# Altium schematic sheet SkyPulse_UAV_Motherboard.SchDoc: SkyPulse UAV
size A4; Project: No.1; ENG_APP_DATE: --/--/--; DSN_APP_DATE: --/--/--; CHK_APP_DATE: --/--/--; Date: Feb. 04, 2024; Author: Binhan Tian; Revision: V0.1; SheetNumber: 1; SheetTotal: 3
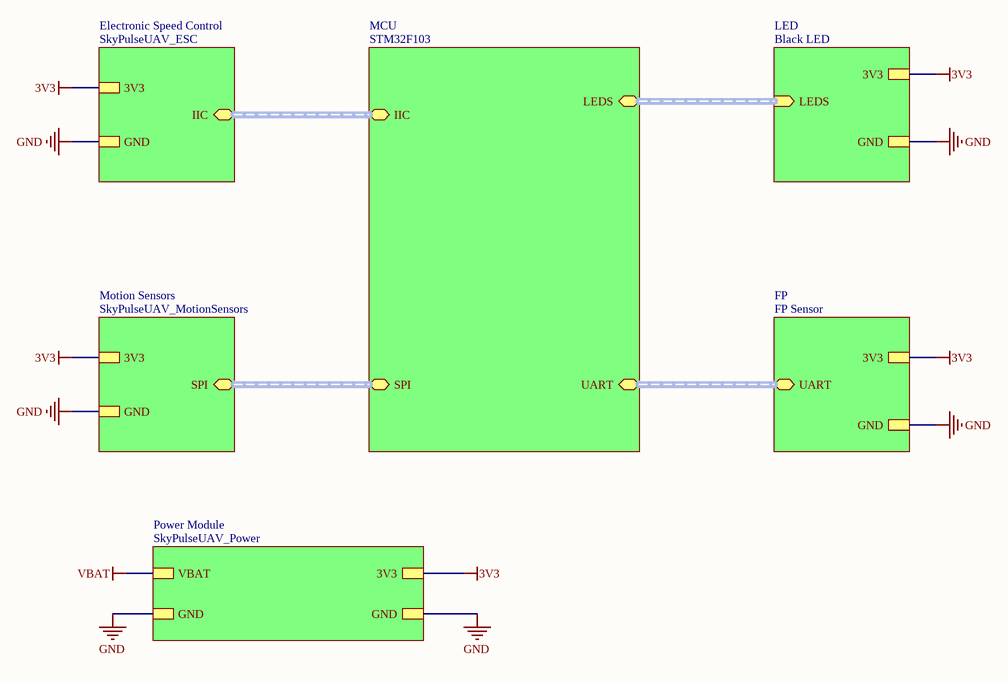
[diagram p0: SkyPulse_UAV_Motherboard.SchDoc]

## Sub-sheets
Electronic Speed Control = SkyPulseUAV_ESC: IIC (bidir), 3V3, GND
FP = FP Sensor: UART (bidir), 3V3, GND
LED = Black LED: LEDS (in), 3V3, GND
MCU = STM32F103: IIC (bidir), SPI (bidir), LEDS (bidir), UART (bidir)
Motion Sensors = SkyPulseUAV_MotionSensors: SPI (bidir), 3V3, GND
Power Module = SkyPulseUAV_Power: VBAT, GND, 3V3, GND

## Nets
3V3: sheet FP/3V3, sheet Electronic Speed Control/3V3, sheet Motion Sensors/3V3, sheet LED/3V3, sheet Power Module/3V3
GND: sheet FP/GND, sheet Electronic Speed Control/GND, sheet Motion Sensors/GND, sheet LED/GND, sheet Power Module/GND, sheet Power Module/GND
VBAT: sheet Power Module/VBAT

## Buses and harness runs
harness sheet Electronic Speed Control/IIC = sheet MCU/IIC
harness sheet FP/UART = sheet MCU/UART
harness sheet LED/LEDS = sheet MCU/LEDS
harness sheet MCU/SPI = sheet Motion Sensors/SPI

## Notes on the sheet
- TITLE:
- SIZE
- AUTHOR:
- REVISION:
- DATA:
- FILE NAME:
- A4
- SHEET
- OF